# EAGLE design CurrentStabilizer_VER3 (EAGLE 6.1)
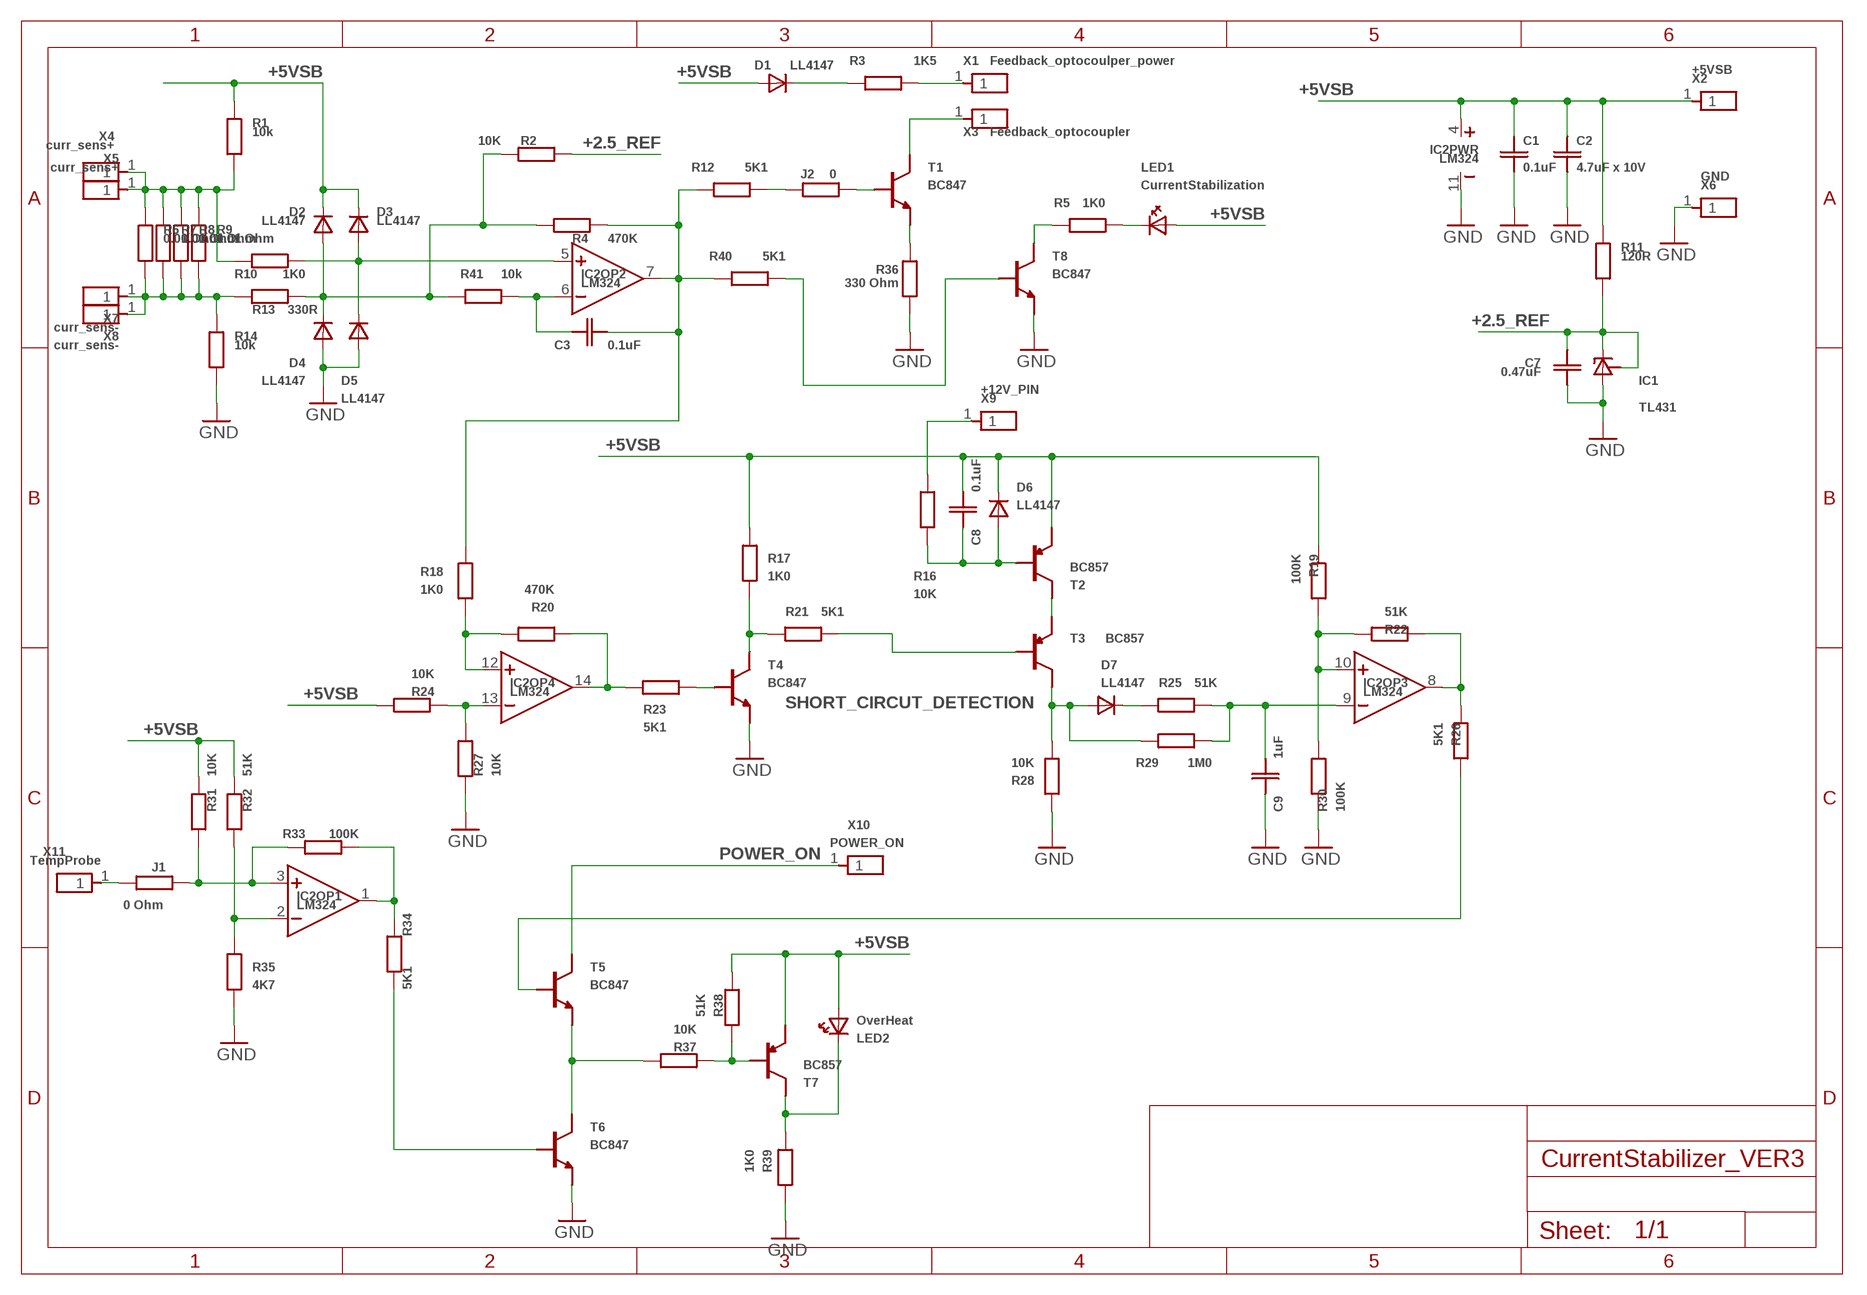
[diagram p0: schematic, sheet 1]

## Parts
C1  0.1uF  CSMD_0805  [RSMD_0805]
C2  4.7uF x 10V  CSMD_1206  [RSMD_1206]
C3  0.1uF  CSMD_0805  [RSMD_0805]
C7  0.47uF  CSMD_0805  [RSMD_0805]
C8  0.1uF  CSMD_0805  [RSMD_0805]
C9  1uF  CSMD_0805  [RSMD_0805]
D1  LL4147  LL4147SOD-80  [SOD-80]
D2  LL4147  LL4147SOD-80  [SOD-80]
D3  LL4147  LL4147SOD-80  [SOD-80]
D4  LL4147  LL4147SOD-80  [SOD-80]
D5  LL4147  LL4147SOD-80  [SOD-80]
D6  LL4147  LL4147SOD-80  [SOD-80]
D7  LL4147  LL4147SOD-80  [SOD-80]
IC1  TL431  TL431SOT23  [SOT23]
IC2  LM324  [SOIC14]
J1  0 Ohm  RSMD_0805  [RSMD_0805]
J2  0  RSMD_0805  [RSMD_0805]
LED1  CurrentStabilization  LED3MM  [LED3MM]
LED2  OverHeat  LED3MM  [LED3MM]
R1  10k  RSMD_0805  [RSMD_0805]
R2  10K  RSMD_0805  [RSMD_0805]
R3  1K5  RSMD_0805  [RSMD_0805]
R4  470K  RSMD_0805  [RSMD_0805]
R5  1K0  RSMD_0805  [RSMD_0805]
R6  0.01 Ohm  RSMD_2512  [RSMD_2512]
R7  0.01 Ohm  RSMD_2512  [RSMD_2512]
R8  0.01 Ohm  RSMD_2512  [RSMD_2512]
R9  0.01 Ohm  RSMD_2512  [RSMD_2512]
R10  1K0  RSMD_0805  [RSMD_0805]
R11  120R  RSMD_0805  [RSMD_0805]
R12  5K1  RSMD_0805  [RSMD_0805]
R13  330R  RSMD_0805  [RSMD_0805]
R14  10k  RSMD_0805  [RSMD_0805]
R16  10K  RSMD_0805  [RSMD_0805]
R17  1K0  RSMD_0805  [RSMD_0805]
R18  1K0  RSMD_0805  [RSMD_0805]
R19  100K  RSMD_1206_BIG_GAP  [RSMD_1206_BIG_GAP]
R20  470K  RSMD_0805  [RSMD_0805]
R21  5K1  RSMD_0805  [RSMD_0805]
R22  51K  RSMD_0805  [RSMD_0805]
R23  5K1  RSMD_1206_BIG_GAP  [RSMD_1206_BIG_GAP]
R24  10K  RSMD_0805  [RSMD_0805]
R25  51K  RSMD_0805  [RSMD_0805]
R26  5K1  RSMD_0805  [RSMD_0805]
R27  10K  RSMD_0805  [RSMD_0805]
R28  10K  RSMD_0805  [RSMD_0805]
R29  1M0  RSMD_0805  [RSMD_0805]
R30  100K  RSMD_0805  [RSMD_0805]
R31  10K  RSMD_0805  [RSMD_0805]
R32  51K  RSMD_0805  [RSMD_0805]
R33  100K  RSMD_0805  [RSMD_0805]
R34  5K1  RSMD_0805  [RSMD_0805]
R35  4K7  RSMD_0805  [RSMD_0805]
R36  330 Ohm  RSMD_0805  [RSMD_0805]
R37  10K  RSMD_1206_BIG_GAP  [RSMD_1206_BIG_GAP]
R38  51K  RSMD_0805  [RSMD_0805]
R39  1K0  RSMD_0805  [RSMD_0805]
R40  5K1  RSMD_0805  [RSMD_0805]
R41  10k  RSMD_0805  [RSMD_0805]
T1  BC847  BC847SOT23_SMALL_PADS  [SOT23_SMALL_PADS]
T2  BC857  BC857SOT23_SMALL_PADS  [SOT23_SMALL_PADS]
T3  BC857  BC857SOT23_SMALL_PADS  [SOT23_SMALL_PADS]
T4  BC847  BC847SOT23_SMALL_PADS  [SOT23_SMALL_PADS]
T5  BC847  BC847SOT23_SMALL_PADS  [SOT23_SMALL_PADS]
T6  BC847  BC847SOT23_SMALL_PADS  [SOT23_SMALL_PADS]
T7  BC857  BC857SOT23_SMALL_PADS  [SOT23_SMALL_PADS]
T8  BC847  BC847SOT23_SMALL_PADS  [SOT23_SMALL_PADS]
X1  Feedback_optocoulper_power  PIN1X12.54MM  [PIN1X1_2.54MM]
X2  +5VSB  PIN1X12.54MM  [PIN1X1_2.54MM]
X3  Feedback_optocoupler  PIN1X12.54MM  [PIN1X1_2.54MM]
X4  curr_sens+  PIN1X12.54MM  [PIN1X1_2.54MM]
X5  curr_sens+  PIN1X12.54MM  [PIN1X1_2.54MM]
X6  GND  PIN1X12.54MM  [PIN1X1_2.54MM]
X7  curr_sens-  PIN1X12.54MM  [PIN1X1_2.54MM]
X8  curr_sens-  PIN1X12.54MM  [PIN1X1_2.54MM]
X9  +12V_PIN  PIN1X12.54MM  [PIN1X1_2.54MM]
X10  POWER_ON  PIN1X12.54MM  [PIN1X1_2.54MM]
X11  TempProbe  PIN1X12.54MM  [PIN1X1_2.54MM]

## Nets
+2.5_REF: C7.PAD_1(PIN1) IC1.1(CATHODE) IC1.2(REFERENCE) R2.PAD_0(PIN0) R11.PAD_0(PIN0)
+5VSB: C1.PAD_1(PIN1) C2.PAD_1(PIN1) C8.PAD_0(PIN0) D1.ANODE D2.CATHODE D3.CATHODE D6.CATHODE IC2.4(PWR:VCC) LED1.ANODE LED2.ANODE R1.PAD_1(PIN1) R11.PAD_1(PIN1) R17.PAD_0(PIN0) R19.PAD_0(PIN0) R24.PAD_1(PIN1) R31.PAD_1(PIN1) R32.PAD_1(PIN1) R38.PAD_0(PIN0) T2.2(E) T7.2(E) X2.1
GND: C1.PAD_0(PIN0) C2.PAD_0(PIN0) C7.PAD_0(PIN0) C9.PAD_1(PIN1) D4.ANODE D5.ANODE IC1.3(ANODE) IC2.11(PWR:GND) R14.PAD_0(PIN0) R27.PAD_0(PIN0) R28.PAD_1(PIN1) R30.PAD_0(PIN0) R35.PAD_0(PIN0) R36.PAD_0(PIN0) R39.PAD_1(PIN1) T4.2(E) T6.2(E) T8.2(E) X6.1
N$1: R1.PAD_0(PIN0) R6.PAD1(PIN1) R7.PAD1(PIN1) R8.PAD1(PIN1) R9.PAD1(PIN1) R10.PAD_0(PIN0) X4.1 X5.1
N$2: R6.PAD0(PIN0) R7.PAD0(PIN0) R8.PAD0(PIN0) R9.PAD0(PIN0) R13.PAD_0(PIN0) R14.PAD_1(PIN1) X7.1 X8.1
N$3: D3.ANODE D5.CATHODE IC2.5(OP2:IN+) R10.PAD_1(PIN1)
N$4: D2.ANODE D4.CATHODE R2.PAD_1(PIN1) R4.PAD_0(PIN0) R13.PAD_1(PIN1) R41.PAD_1(PIN1)
N$5: IC2.12(OP4:IN+) R18.PAD_0(PIN0) R20.PAD_0(PIN0)
N$6: IC2.3(OP1:IN+) J1.PAD_0(PIN0) R31.PAD_0(PIN0) R33.PAD_1(PIN1)
N$7: R5.PAD_1(PIN1) T8.3(C)
N$8: R23.PAD_0(PIN0) T4.1(B)
N$9: D1.CATHODE R3.PAD_1(PIN1)
N$10: T1.3(C) X3.1
N$11: IC2.14(OP4:OUT) R20.PAD_1(PIN1) R23.PAD_1(PIN1)
N$12: R17.PAD_1(PIN1) R21.PAD_0(PIN0) T4.3(C)
N$13: R37.PAD_0(PIN0) R38.PAD_1(PIN1) T7.1(B)
N$14: R36.PAD_1(PIN1) T1.2(E)
N$15: IC2.2(OP1:IN-) R32.PAD_0(PIN0) R35.PAD_1(PIN1)
N$16: IC2.1(OP1:OUT) R33.PAD_0(PIN0) R34.PAD_1(PIN1)
N$17: R34.PAD_0(PIN0) T6.1(B)
N$18: J2.PAD_0(PIN0) T1.1(B)
N$19: C8.PAD_1(PIN1) D6.ANODE R16.PAD_1(PIN1) T2.1(B)
N$20: R16.PAD_0(PIN0) X9.1
N$21: T2.3(C) T3.2(E)
N$22: R21.PAD_1(PIN1) T3.1(B)
N$23: D7.CATHODE R25.PAD_0(PIN0)
N$24: C9.PAD_0(PIN0) IC2.9(OP3:IN-) R25.PAD_1(PIN1) R29.PAD_0(PIN0)
N$25: IC2.10(OP3:IN+) R19.PAD_1(PIN1) R22.PAD_1(PIN1) R30.PAD_1(PIN1)
N$26: IC2.8(OP3:OUT) R22.PAD_0(PIN0) R26.PAD_0(PIN0)
N$27: R26.PAD_1(PIN1) T5.1(B)
N$28: R37.PAD_1(PIN1) T5.2(E) T6.3(C)
N$29: IC2.13(OP4:IN-) R24.PAD_0(PIN0) R27.PAD_1(PIN1)
N$30: C3.PAD_0(PIN0) IC2.7(OP2:OUT) R4.PAD_1(PIN1) R12.PAD_1(PIN1) R18.PAD_1(PIN1) R40.PAD_1(PIN1)
N$31: R3.PAD_0(PIN0) X1.1
N$32: J1.PAD_1(PIN1) X11.1
N$33: J2.PAD_1(PIN1) R12.PAD_0(PIN0)
N$34: LED2.CATHODE R39.PAD_0(PIN0) T7.3(C)
N$35: LED1.CATHODE R5.PAD_0(PIN0)
N$36: R40.PAD_0(PIN0) T8.1(B)
N$37: C3.PAD_1(PIN1) IC2.6(OP2:IN-) R41.PAD_0(PIN0)
POWER_ON: T5.3(C) X10.1
SHORT_CIRCUT_DETECTION: D7.ANODE R28.PAD_0(PIN0) R29.PAD_1(PIN1) T3.3(C)

## Library data of the parts
C1-C3 C7-C9 = __MyCommonLib1:C
D1-D7 = __MyCommonLib1:LL4147
IC1 = __MyCommonLib1:TL431
IC2 = __MyCommonLib1:LM324
J1 J2 R1-R14 R16-R41 = __MyCommonLib1:R
LED1 LED2 = __MyCommonLib1:LED3MM
T1 T4-T6 T8 = __MyCommonLib1:BC847
T2 T3 T7 = __MyCommonLib1:BC857
X1-X11 = __MyCommonLib1:PIN1X1

## Board
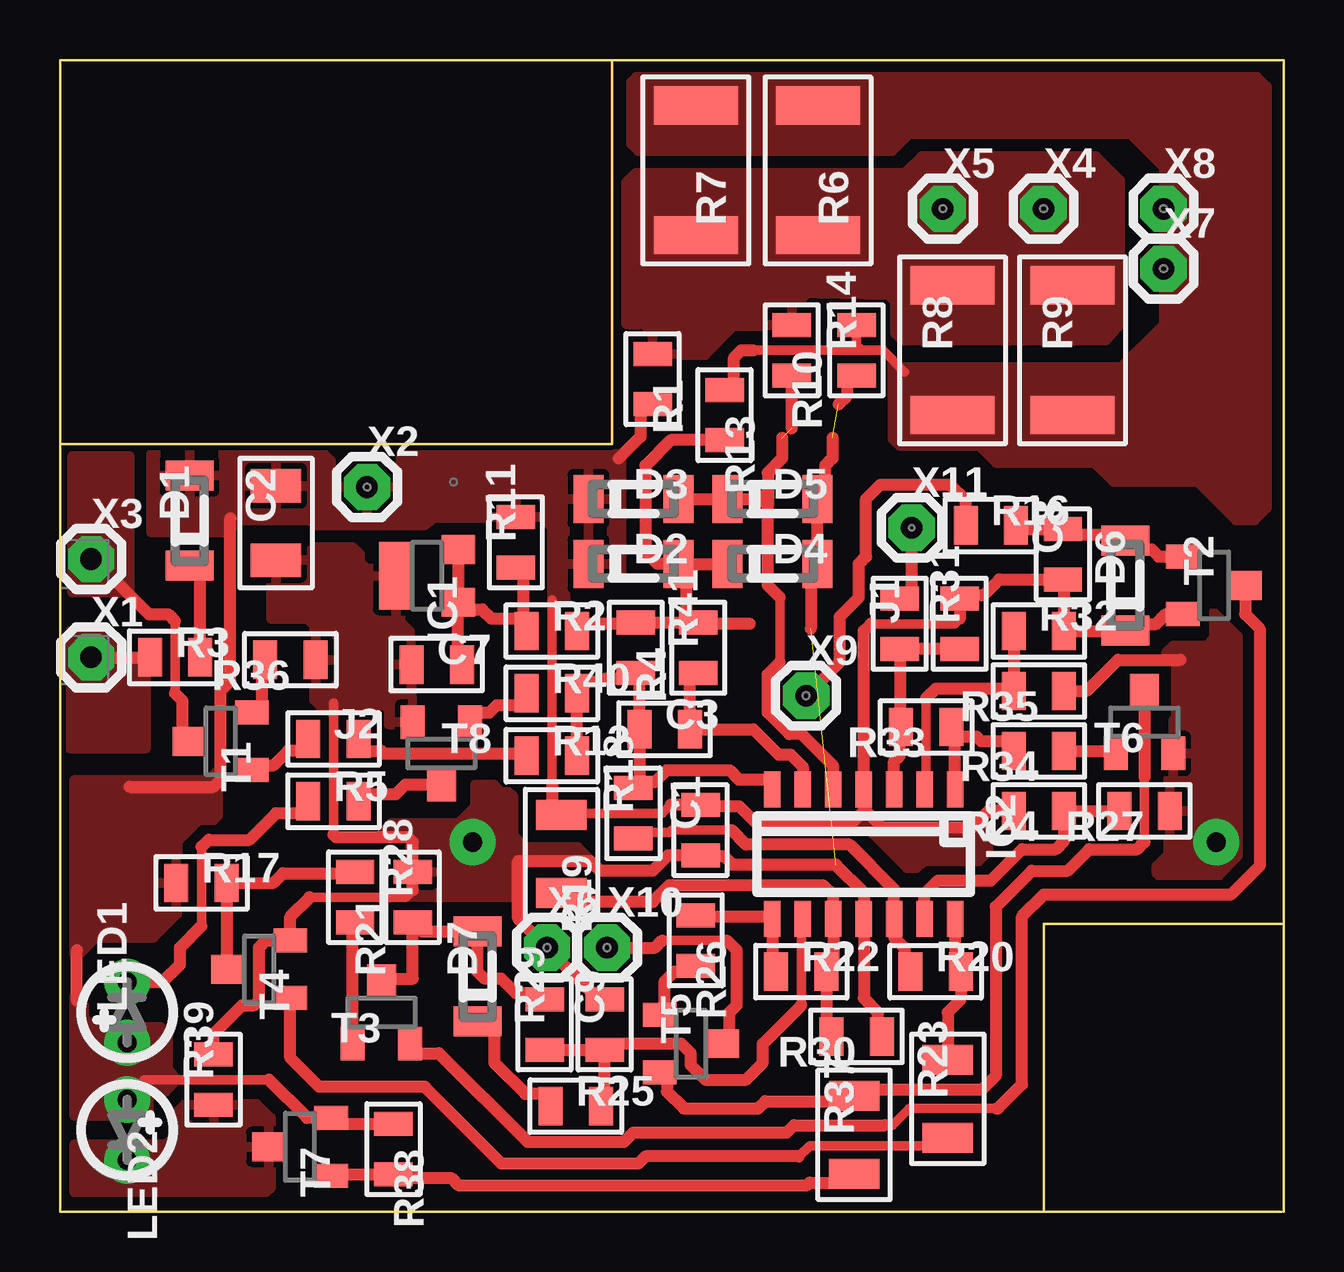
[diagram p1: board, top side]
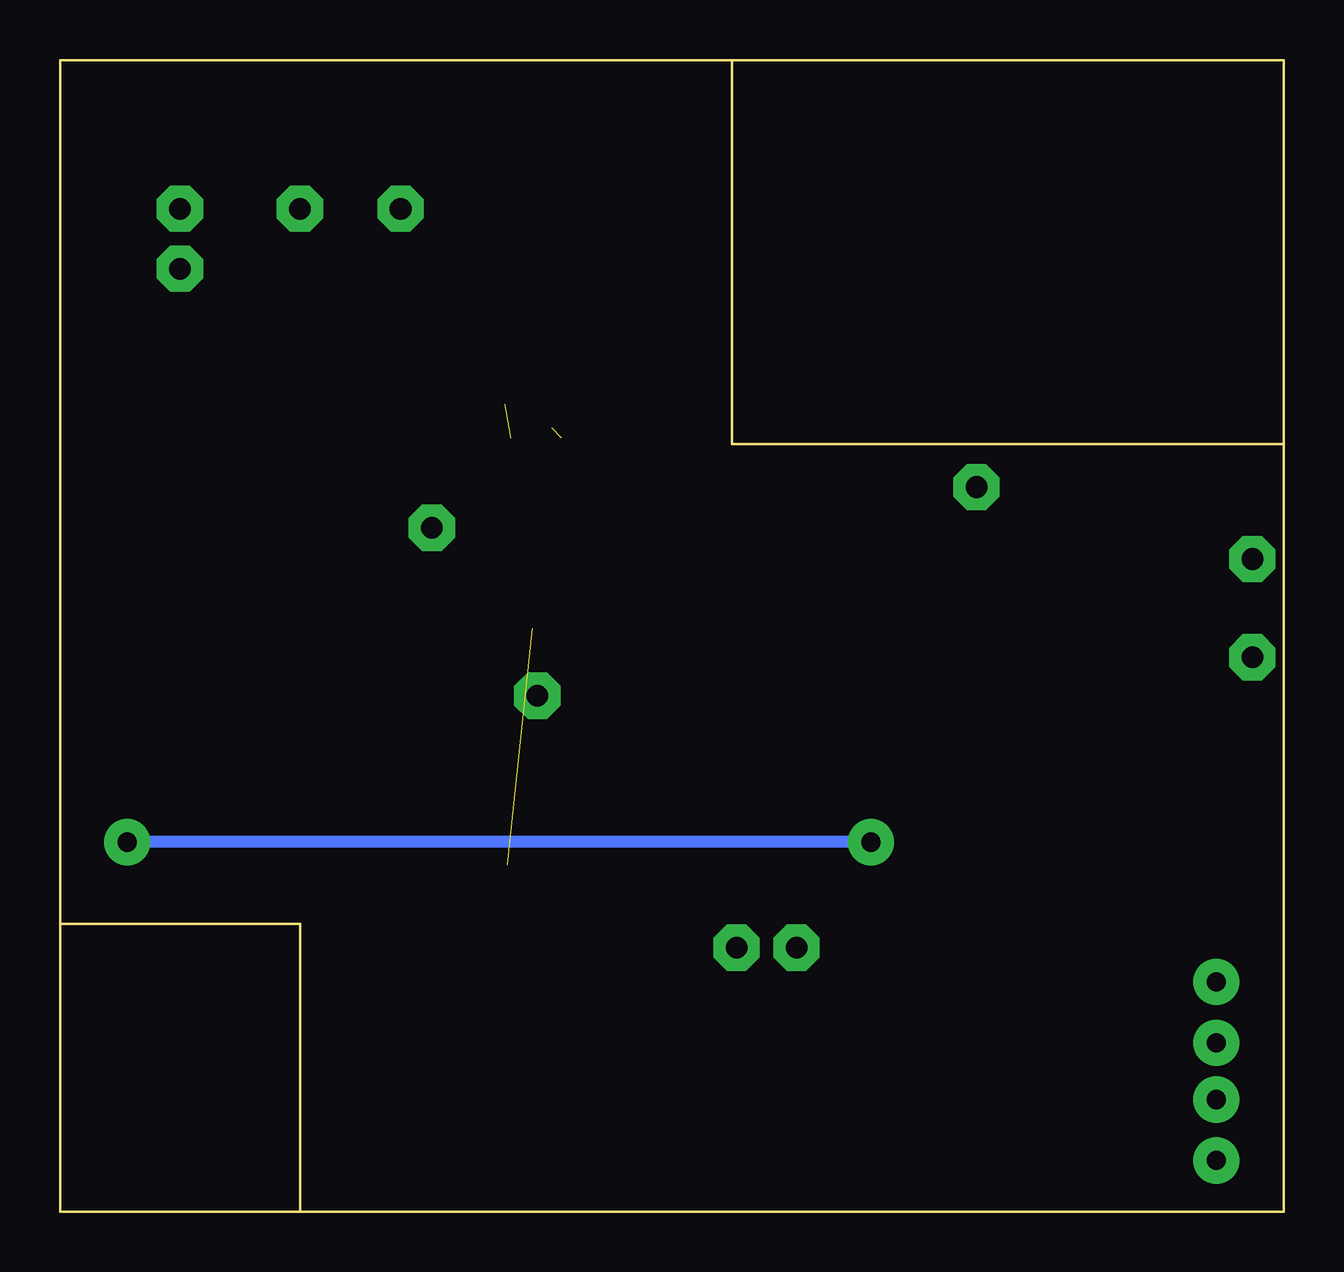
[diagram p2: board, bottom side, seen from below]

Size 51 x 48 mm. Coordinates in mm from the lower left corner, seen from the top.
Outline: 51,12 51,48 23,48
Outline: 41,0 0,0 0,32
Outline: 0,32 23,32 23,48
Outline: 41,0 41,12 51,12
Outline: 51,0 51,12
Outline: 41,0 50.9,0
Outline: 23,48 0,48 0,32
Copper layers (1*16): Top 0.035mm / dielectric 1.5mm / Bottom 0.035mm
Design rules: minimum track width 0.4mm, minimum drill 0.6mm, track to track 0.35mm, track to pad 0.35mm, pad to pad 0.35mm, via to via 0.35mm, smd to smd 0mil, copper to edge 0.2mm, drill to drill 1mm, minimum pad ring 0.35mm, minimum via ring 0.35mm, stop-mask expansion 0mil, vias tented up to drill 0mil, thermal gap 10mil

### Footprints (pad centres in the part's own frame; a part is rotated, then mirrored left to right if it is on the bottom)
RSMD_0805 = smd 1 x 1.6: PAD_0 -1.05,0; PAD_1 1.05,0
RSMD_1206 = smd 1.4 x 2.1: PAD_0 -1.55,0; PAD_1 1.55,0
SOD-80 = smd 1.25 x 2: ANODE 1.875,0; CATHODE -1.875,0
SOT23 = smd 1.2 x 1.4: 1 1.1,1.3; 2 -1.1,1.3 | smd 2.8 x 1.4: 3 0,-1.3
SOIC14 = smd 1.5 x 0.68: 1 -2.699,3.81; 2 -2.699,2.54; 3 -2.699,1.27; 4 -2.699,0; 5 -2.699,-1.27; 6 -2.699,-2.54; 7 -2.699,-3.81; 8 2.699,-3.81; 9 2.699,-2.54; 10 2.699,-1.27; 11 2.699,0; 12 2.699,1.27; 13 2.699,2.54; 14 2.699,3.81
LED3MM = drill 0.8 pad 1.93: ANODE -1.27,0; CATHODE 1.27,0
RSMD_2512 = smd 1.6 x 3.5: PAD0 -2.7,0; PAD1 2.7,0
RSMD_1206_BIG_GAP = smd 1.25 x 2.1: PAD_0 -1.625,0; PAD_1 1.625,0
SOT23_SMALL_PADS = smd 1 x 1.4: 1 1.2,1.3; 2 -1.2,1.3 | smd 1.2 x 1.4: 3 0,-1.3
PIN1X1_2.54MM = drill 0.9 pad 1.93 octagon: 1 0,0

### Placement (x,y rotation side)
C1  26.7,15.9 90 top
C2  9,28.7 90 top
C3  25.2,20.1 0 top
C7  15.7,22.8 0 top
C8  41.8,27.4 90 top
C9  22.7,7.8 90 top
D1  5.4,28.8 90 top
D2  23.9,27 0 top
D3  23.9,29.7 0 top
D4  29.7,27 0 top
D5  29.7,29.7 0 top
D6  44.4,26.1 90 top
D7  17.4,9.8 90 top
IC1  15.3,26.5 270 top
IC2  33.5,14.9 270 top
J1  35,24.5 90 top
J2  11.4,19.7 0 top
LED1  2.8,8.3 90 top
LED2  2.8,3.4 270 top
R1  24.7,34.7 270 top
R2  20.5,24.2 0 top
R3  4.8,23.1 0 top
R4  24,23.5 270 top
R5  11.4,17.1 0 top
R6  31.6,43.4 270 top
R7  26.5,43.4 270 top
R8  37.2,35.9 90 top
R9  42.2,35.9 90 top
R10  30.5,35.9 270 top
R11  19,27.9 90 top
R12  20.5,19 0 top
R13  27.7,33.2 270 top
R14  33.2,35.9 90 top
R16  38.8,28.6 0 top
R17  5.9,13.7 0 top
R18  23.9,16.6 90 top
R19  20.9,14.9 270 top
R20  36.5,10 0 top
R21  12.3,13.1 270 top
R22  30.9,10 0 top
R23  37,4.7 90 top
R24  40.8,16.7 180 top
R25  21.5,4.4 0 top
R26  26.5,11.3 270 top
R27  45.2,16.7 180 top
R28  14.7,13.1 90 top
R29  20.2,7.8 90 top
R30  33.2,7.3 180 top
R31  37.5,24.5 90 top
R32  40.8,24.2 0 top
R33  36.1,20.2 180 top
R34  40.8,19.2 180 top
R35  40.8,21.7 180 top
R36  9.6,23 180 top
R37  33.1,3.2 90 top
R38  13.9,2.6 270 top
R39  6.4,5.5 90 top
R40  20.5,21.6 0 top
R41  26.6,23.5 90 top
T1  6.7,19.6 270 top
T2  48.1,26.1 90 top
T3  13.4,8.3 180 top
T4  8.3,10.1 270 top
T5  26.3,7 90 top
T6  45.2,20.4 180 top
T7  10,2.7 270 top
T8  15.9,19.1 0 top
X1  1.3,23.1 0 top
X2  12.8,30.2 0 top
X3  1.3,27.2 0 top
X4  41,41.8 0 top
X5  36.8,41.8 0 top
X6  20.3,11 0 top
X7  46,39.3 0 top
X8  46,41.8 0 top
X9  31.1,21.5 0 top
X10  22.8,11 0 top
X11  35.5,28.5 0 top

### Tracks (layer width: path | path; a pad name or v marks a point on that pad's centre or on a via)
+2.5_REF
  Top 0.5: R2.PAD_0 19.45,24.7 19.3,24.7 | 19.3,24.7 18,24.7 17.6,25.1 16.9,25.1 IC1.1 | C7.PAD_1 16.6,22.95 IC1.1 | IC1.2 IC1.1 | R11.PAD_0 19.3,26.55 19.3,24.7
+5VSB
  Top 0.4: 20.5,17.9 20.5,25.5 | 8.7,5.5 3.5,5.5 | 25.45,16.95 25.1,16.6 21.45,16.6 | 33.8,24.5 37.3,24.5 37.5,24.7
  Top 0.5: R1.PAD_1 24.2,33.65 24.2,32.3 23.3,31.4 | 2.9,17.7 6.4,17.7 6.7,18 6.7,21.7 7.1,22.1 7.1,28.9 | 8.7,5.5 10.3,3.9 T7.2 11.55,3.65 R38.PAD_0 | T2.2 46.1,24.9 45.7,24.5 44.67,24.5 D6.CATHODE 44.38,24.2 R32.PAD_1 41.85,26.3 C8.PAD_0 39.15,26.35 38.5,25.7 37.65,25.7 R31.PAD_1 37.5,24.7 | 33.6,16.7 33.5,16.7 33,16.2 29,16.2 28.3,16.9 26.75,16.9 C1.PAD_1 25.45,16.95 | 39.75,16.45 R24.PAD_1 38.7,16.7 38,16 34.3,16 33.6,16.7 | 33.8,24.5 33.5,24.2 IC2.4 33.5,16.8 33.6,16.7 | 0.7,8.8 0.7,10.9 | 20.5,17.9 20.5,16.93 R19.PAD_0 20.98,16.6 21.45,16.6
  pour Top: 3.8,31.6 3.8,28.3 7.1,28.3 7.1,28.4 7.5,28.8 10.5,28.8 10.7,28.6 15.2,28.6 15.6,28.9 20.1,28.9 20.5,28.5 20.5,25.5 21,25.5 21.8,26.4 23.4,26.4 23.4,31.6 14.4,31.6 14.2,31.4 14.2,30.4 14,30.2 11.4,30.2 11.3,30.3 11.3,31.3 11,31.6
  pour Top (no thermals): 3.7,4 0.6,4 0.6,9 1,8.6 1,8.1 1.4,7.7 4.2,7.7 4.5,7.4 4.5,5.9 4.9,5.5 4.4,5 4,5 3.7,4.7
  pour Top: 0.7,10.6 1.5,11.4 3.9,11.4 4.9,12.4 4.9,15.4 5.8,16.3 6.4,16.3 6.6,16.5 6.6,18.4 6.2,18 0.6,18 0.6,10.7
  pour Top: 33,16.2 33.4,16.2 35.3,14.3 35.7,14.3 36,14.6 38.3,14.6 38.7,15 38.7,15.5 38.5,15.7 38.5,16.5 38,16 34.3,16 34.2,16.1 34.1,16.1 33.5,16.7
GND  (via drill 0.8 pad 1.93)  (2 unrouted)
  Top 0.4: 10.4,13.1 14.4,13.1 14.7,13.4 | 11.4,15.7 11.4,21.2
  Top 0.5: R14.PAD_0 32.8,34.45 32.8,34 32.45,33.65 | R39.PAD_1 6.4,7.4 7.6,8.6 8.1,8.6 8.3,8.8 8.3,11 8.6,11.3 T4.2 9.6,12.3 10.4,13.1 | 14.7,13.4 R28.PAD_1 14.7,15.4 14.5,15.6 11.5,15.6 11.4,15.7 | R35.PAD_0 42.8,21.7 44.1,23 46.7,23 | R30.PAD_0 34.1,7.3 34.1,8.3 33.5,8.9 IC2.11 33.5,13.3 32.35,14.45 28.05,14.45 27.7,14.8 26.75,14.8 C1.PAD_0 25.35,14.85 24.7,14.2 22.5,14.2 22.1,14.6 19.1,14.6 19.1,12.2 X6.1 22.45,8.85 C9.PAD_1 | 32.2,32.25 32.2,31.4 31.9,31.1 31.9,30.02 D5.ANODE D4.ANODE 31.3,27 31.3,24.3
  Bottom 0.5: v17.2,15.4 v48.2,15.4
  pour Top: 10.6,24.4 10.6,21.3 10.9,21 11.1,21 11.4,20.7 11.8,21.1 13.5,21.1 13.7,20.9 13.7,20.3 14.7,20.3 14.6,24.2 14.2,24.6 14.2,26.8 12.8,26.8 12.5,27.1 12.5,27.4 12.2,27.7 10.6,27.7 10.1,27.2 8.8,27.2 8.8,24.7 10.3,24.7
  pour Top: 14.6,15.4 14.6,13.1 19,13.1 19,14.2 19.4,14.6 22.2,14.6 21.6,15.2 19.4,15.2 18.9,15.7 18.9,17.3 18.7,17.5 18.4,17.5 18.1,17.8 17.3,17.8 17.3,16.9 16.6,16.2 13.8,16.2 13.2,15.6 14.4,15.6
  pour Top: 46.2,19 46.2,14.9 45.7,14.4 45.7,14.1 45.8,14 48.3,14 49.1,14.8 49.1,24 48.1,25 48.1,23.9 47.8,23.6 46.4,23.6 46.1,23.3 46.1,23 46.5,23 46.5,20.6 46.4,20.5 46.4,19
N$1
  pour Top (no thermals): 23.6,38.3 29.6,38.3 34.5,38.2 34.8,37.9 34.8,36.6 35.1,36.3 43.6,36.3 44.2,37 44.2,43 43.2,44 35.9,44 35.2,43.3 24,43.3 23.6,42.9
  pour Top: 23.6,38.2 23.6,37 24.3,37 24.6,36.7 24.6,35.7 26.9,35.7 28.1,36.9 30.6,36.9 30.6,37.7 31.1,38.2 31.1,39.1 23.6,39.1
N$2
  Top 0.4: 28.9,35.9 33,35.9 | 33,35.9 33.2,36.1 | R14.PAD_1 33.2,36.1 | 33.2,36.1 33.4,35.9 | 33.4,35.9 33,35.9 | 33.4,35.9 34.3,35.9 35.2,35
  Top 0.5: R13.PAD_0 28.1,34.25 28.1,35.6 28.4,35.9 28.9,35.9
  pour Top (no thermals): 44.2,35.2 35,35.2 34.7,35.5 34.7,32.2 35,31.9 38.3,31.9 39,31.2 43.1,31.2 43.9,30.4 47.4,30.4 49,28.8 49.8,28.8 50.3,29.3 50.3,46.9 49.9,47.3 24,47.3 23.8,47.1 23.8,44.5 24.1,44.2 34.7,44.2 35.4,44.9 44.6,44.9 46,43.5 46,37
N$3  (1 unrouted)
  Top 0.4: 30,22.9 30,25.6
  Top 0.5: 30,25.6 29.5,26.1 29.5,29.4 | D3.ANODE D5.CATHODE 29.2,29.7 | 30,22.9 29.5,22.4 29.5,20.8 30.4,19.9 30.9,19.9 32.23,18.57 IC2.5 | 29.5,29.4 29.2,29.7 | 29.2,29.7 29.5,30 | 29.5,30 29.5,29.4 | 30.1,32.25 30.1,31.4 29.5,30.8 29.5,30 | 30.5,32.65 R10.PAD_1
N$4
  Top 0.5: D2.ANODE D4.CATHODE | D2.ANODE 24.9,27 24.4,27.5 24.4,31.1 25.45,32.15 R13.PAD_1 | R2.PAD_1 21.85,24.5 23.95,24.5 R4.PAD_0 26.1,24.55 | R41.PAD_1 26.65,24.5 28.75,24.5 | 26.1,24.55 R41.PAD_1 | R41.PAD_1 26.6,24.6 | D2.ANODE 26.1,27 26.1,24.55
N$5
  Top 0.4: 28,15.9 25.5,15.9 25.4,15.8 24.1,15.8
  Top 0.5: R20.PAD_0 35.2,10.25 35.2,11 34.77,11.43 IC2.12 34.77,13.43 32.9,15.3 28.6,15.3 28,15.9 | R18.PAD_0 23.9,15.6 24.1,15.8
N$6
  Top 0.5: IC2.3 34.77,18.77 35,19 35,20.15 R33.PAD_1 35,20.25 J1.PAD_0 R31.PAD_0
N$7
  Top 0.5: R5.PAD_1 12.75,17.4 14,17.4 14.4,17.8 T8.3
N$8
  Top 0.4: 30.8,2.3 31.25,2.75 36.7,2.75 36.7,2.77 R23.PAD_0
  Top 0.5: T4.1 9.6,6.4 10.8,5.2 15.2,5.2 18.4,2 24.1,2 24.4,2.3 30.8,2.3
N$9
  Top 0.5: R3.PAD_1 5.85,26.45 5.4,26.9 D1.CATHODE
N$10
  Top 0.4: 4.8,24.6 4.8,21.6
  Top 0.5: 4.8,24.6 4.5,24.9 3.7,24.9 2.5,26.1 | 4.8,21.6 5.1,21.3 5.1,19.9 T1.3
  pour Top (no thermals): 0.5,31.5 0.5,25.8 2.9,25.8 2.9,31.5
N$11
  Top 0.5: IC2.14 37.31,10.24 R20.PAD_1 37.55,8.85 37,8.3 R23.PAD_1
N$12
  Top 0.5: 12.25,14.2 R21.PAD_0 12.25,14.1 9.3,14.1 8.9,13.7 R17.PAD_1 6.95,10.15 T4.3
N$13
  Top 0.5: T7.1 11.35,1.55 R38.PAD_1 14.05,1.4 16.3,1.4 16.6,1.1 31.15,1.1 31.25,1.2 32.75,1.2 32.75,1.23 R37.PAD_0
N$14
  Top 0.5: T1.2 8.4,21.2 8.4,22.85 R36.PAD_1
N$15
  Top 0.4: 36.1,17.66 36.1,21.4
  Top 0.5: R32.PAD_0 R35.PAD_1 39.65,21.8 36.5,21.8 36.1,21.4 | IC2.2 36.1,17.66
N$16
  Top 0.5: R34.PAD_1 39.75,19.6 38.4,19.6 38.2,19.8 37.15,19.8 R33.PAD_0 37.31,20.04 IC2.1
N$17
  Top 0.5: R34.PAD_0 43.9,19.2 T6.1
N$18
  Top 0.5: T1.1 8.2,18.6 8.9,18.6 9.5,19.2 10.35,19.2 J2.PAD_0
N$19
  Top 0.5: T2.1 45.8,27.3 45.5,27.6 44.77,27.6 D6.ANODE 44.17,28.2 42.05,28.2 C8.PAD_1 40,28.45 R16.PAD_1
N$20
  Top 0.5: X9.1 32.5,22.9 32.5,24.8 33.3,25.6 33.3,27 33.6,27.3 33.6,29.7 34.2,30.3 37.1,30.3 37.75,29.65 R16.PAD_0
N$21
  Top 0.4: 39.05,4.3 35.4,4.3 34.7,3.6 34.4,3.6
  Top 0.5: T2.3 49.4,24.9 50,24.3 50,14.4 48.8,13.2 41,13.2 40.1,12.3 40.1,5.3 39.1,4.3 39.05,4.3 | T3.2 15,6.6 15.8,6.6 19.5,2.9 23.5,2.9 23.9,3.3 30.3,3.3 30.6,3.6 34.4,3.6
N$22
  Top 0.5: T3.1 12.2,12 | 12.2,12 12.2,12.1 | R21.PAD_1 12.25,12.05 12.2,12
N$23
  Top 0.5: R25.PAD_0 20.45,4.9 19.4,4.9 18.1,6.2 18.1,7.92 D7.CATHODE
N$24
  Top 0.4: 30.9,12.14 30.9,8.6
  Top 0.5: IC2.9 30.9,12.14 | 30.9,8.6 29.3,7 29.3,6.2 28.6,5.5 26.9,5.5 26.3,6.1 26.3,6.6 25.9,7 22.7,7 C9.PAD_0 | R29.PAD_0 C9.PAD_0 | R25.PAD_1 22.7,4.55 C9.PAD_0
N$25
  Top 0.5: R30.PAD_1 31.95,7.5 R22.PAD_1 32.23,10.28 IC2.10 32.23,13.17 31.8,13.6 25.4,13.6 24.7,12.9 21.27,12.9 R19.PAD_1
N$26
  Top 0.5: R22.PAD_0 29.69,10.16 IC2.8 29.59,12.3 26.55,12.3 R26.PAD_0
N$27
  Top 0.5: T5.1 25.2,8.4 25.2,9.6 25.6,10 26.25,10 R26.PAD_1
N$28
  Top 0.4: 45.2,18.1 45.2,15.4
  Top 0.5: 45.2,15.4 44.9,15.1 42.9,15.1 42,14.2 40.5,14.2 39,12.7 39,5.65 38.45,5.1 33.38,5.1 R37.PAD_1 32.95,4.67 32.95,4.6 29.4,4.6 29.1,4.3 26,4.3 25.3,5 25.3,5.8 T5.2 | T6.3 45.2,18.1
N$29
  Top 0.5: IC2.13 36.04,13.24 36.6,13.8 38.8,13.8 40.1,15.1 41.5,15.1 41.85,15.45 R24.PAD_0 R27.PAD_1
N$30
  Top 0.5: 29.69,17.8 IC2.7 29.69,18 28.3,18 27.9,18.4 25.3,18.4 24.8,17.9 24.15,17.9 | R12.PAD_1 R40.PAD_1 21.55,22.1 22.6,22.1 22.7,22.2 24,22.2 R4.PAD_1 24.15,22.3 C3.PAD_0 24.15,17.9 | R18.PAD_1 24.15,17.9
N$31
  Top 0.5: X1.1 R3.PAD_0
  pour Top (no thermals): 0.4,24.2 0.4,19.3 3.6,19.3 3.6,23.1 2.3,23.1 2.3,23.9 2,24.2
N$32
  Top 0.5: J1.PAD_1 35.5,25.55 X11.1
N$33
  Top 0.5: R12.PAD_0 19.45,19.1 13.4,19.1 13.4,19.2 12.45,19.2 J2.PAD_1
N$34
  pour Top (no thermals): 0.6,2.8 0.6,0.8 4.4,0.8 4.4,2.8
  pour Top: 6.4,4.5 5.2,4.5 4.9,4.2 4.9,3.3 4.4,2.8 4.4,0.8 8.6,0.8 8.8,1 8.8,3.9 8.2,4.5
N$35
  Top 0.4: 5.9,11.9 5.9,15.2
  Top 0.5: LED1.CATHODE 4.27,9.57 5,10.3 5,11 5.9,11.9 | 5.9,15.2 6.2,15.5 7.9,15.5 9,16.6 10.35,16.6 R5.PAD_0
N$36
  Top 0.5: T8.1 17.5,20.8 17.9,20.8 18.2,21.1 18.95,21.1 arc90 R40.PAD_0
N$37
  Top 0.5: R41.PAD_0 26.25,22.45 C3.PAD_1 28.9,20.1 29.95,19.05 30.45,19.05 30.96,18.54 IC2.6
POWER_ON
  Top 0.4: 25.1,11.3 27.8,11.3
  Top 0.5: X10.1 24.8,11 25.1,11.3 | 27.8,11.3 28.2,10.9 28.2,8.6 27.9,8.3 27.9,7.3 T5.3
SHORT_CIRCUT_DETECTION
  Top 0.5: T3.3 13.5,9.7 14.7,9.7 R28.PAD_0 15.08,11.68 D7.ANODE 17.4,10 17.7,9.7 18.4,9.7 19,9.1 19.95,9.1 R29.PAD_1

### Text on the board
tDocu: CS+ | CS- | +5V | GND | Feedback | Rt_sensor | OC_pwr | +12V | POWER_OK | GND